# Altium project SVPXFMC_Carrier_6U.PrjPcb (part 8 of 9)
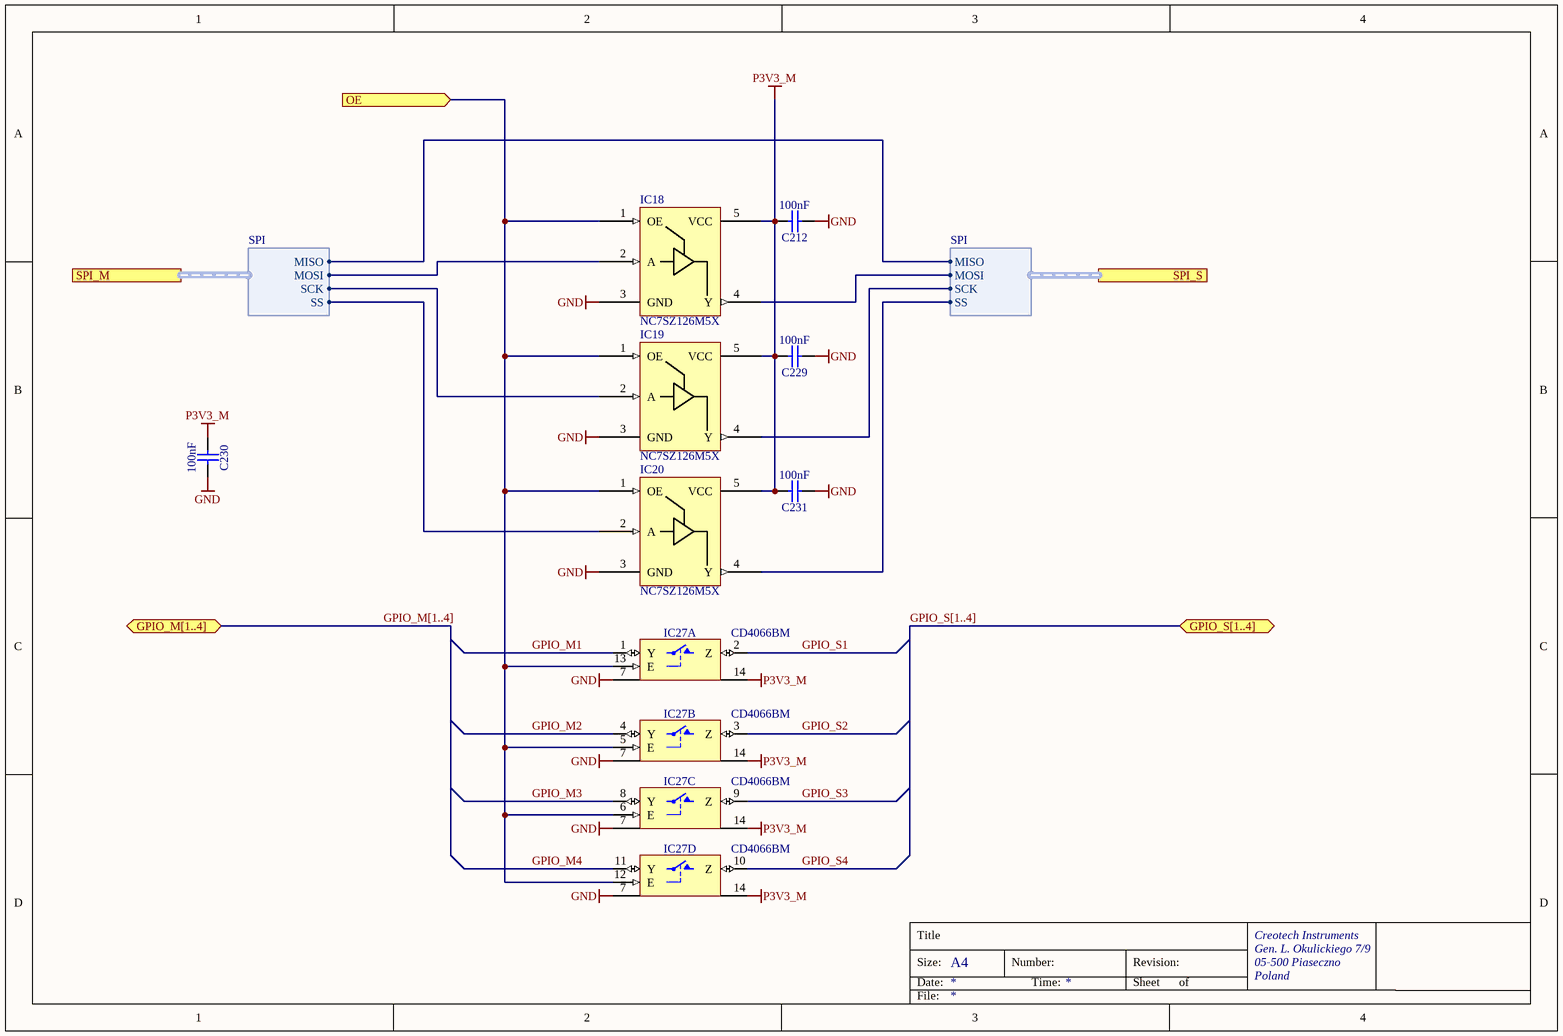
[diagram p23: Interface_Protection.SchDoc]
## Nets that join several sheets
GND: LCL (21 pins), LCL_sch (21 pins), FMC Carrier Channel1/U_FMC_connector (182 pins), FMC Carrier Channel1/FPGA_RGMII_Misc (C225A.1 IC22A.2), FMC Carrier Channel1/Supply for FPGA, FMC and SDRAM (58 pins), FMC Carrier Channel1/U_FPGA SDRAM bank (7 pins), FMC Carrier Channel1/U_FPGA Supply (99 pins), FMC Carrier Channel1/U_DDR4 SDRAM (116 pins), FMC Carrier Channel1/FPGA config (16 pins), FMC Carrier Channel1/U_Decoupling_caps (84 pins), FMC Carrier Channel1/U_CAN_IFC (9 pins), FMC Carrier Channel2/U_FMC_connector (182 pins), FMC Carrier Channel2/FPGA_RGMII_Misc (C225B.1 IC22B.2), FMC Carrier Channel2/Supply for FPGA, FMC and SDRAM (58 pins), FMC Carrier Channel2/U_FPGA SDRAM bank (7 pins), FMC Carrier Channel2/U_FPGA Supply (99 pins), FMC Carrier Channel2/U_DDR4 SDRAM (116 pins), FMC Carrier Channel2/FPGA config (16 pins), FMC Carrier Channel2/U_Decoupling_caps (84 pins), FMC Carrier Channel2/U_CAN_IFC (9 pins), HDN_Control_Data (40 pins), HDN_Management (12 pins), MSP_Telemetry (11 pins), MSP_Power_Program (21 pins), FRAM_memory (6 pins), Interface_prot_A (8 pins), Interface_prot_B (8 pins)
MIC_VIN: FMC Carrier Channel1/Supply for FPGA, FMC and SDRAM (C10A.2 IC12A.4), FMC Carrier Channel2/Supply for FPGA, FMC and SDRAM (C10B.2 IC12B.4)
P1V0: FMC Carrier Channel1/Supply for FPGA, FMC and SDRAM (18 pins), FMC Carrier Channel2/Supply for FPGA, FMC and SDRAM (18 pins)
P1V0_CORE: FMC Carrier Channel1/Supply for FPGA, FMC and SDRAM (IC5A.5 L3A.1 R20A.2), FMC Carrier Channel1/U_FPGA Supply (15 pins), FMC Carrier Channel1/U_Decoupling_caps (17 pins), FMC Carrier Channel2/Supply for FPGA, FMC and SDRAM (IC5B.5 L3B.1 R20B.2), FMC Carrier Channel2/U_FPGA Supply (15 pins), FMC Carrier Channel2/U_Decoupling_caps (17 pins)
P1V0_XCVR: FMC Carrier Channel1/Supply for FPGA, FMC and SDRAM (L3A.2), FMC Carrier Channel1/U_FPGA Supply (16 pins), FMC Carrier Channel1/U_Decoupling_caps (11 pins), FMC Carrier Channel2/Supply for FPGA, FMC and SDRAM (L3B.2), FMC Carrier Channel2/U_FPGA Supply (16 pins), FMC Carrier Channel2/U_Decoupling_caps (11 pins)
P1V2: FMC Carrier Channel1/Supply for FPGA, FMC and SDRAM (6 pins), FMC Carrier Channel2/Supply for FPGA, FMC and SDRAM (6 pins)
P1V2_DDR: FMC Carrier Channel1/Supply for FPGA, FMC and SDRAM (IC23A.5 R22A.2), FMC Carrier Channel1/U_FPGA Supply (12 pins), FMC Carrier Channel1/U_DDR4 SDRAM (89 pins), FMC Carrier Channel1/U_Decoupling_caps (12 pins), FMC Carrier Channel2/Supply for FPGA, FMC and SDRAM (IC23B.5 R22B.2), FMC Carrier Channel2/U_FPGA Supply (12 pins), FMC Carrier Channel2/U_DDR4 SDRAM (89 pins), FMC Carrier Channel2/U_Decoupling_caps (12 pins)
P1V8: FMC Carrier Channel1/Supply for FPGA, FMC and SDRAM (IC28A.5 R164A.2), FMC Carrier Channel1/U_FPGA Supply (U2A#5.P12 U2A#5.P14 U2A#5.P16 U2A#5.R14), FMC Carrier Channel1/U_Decoupling_caps (6 pins), FMC Carrier Channel2/Supply for FPGA, FMC and SDRAM (IC28B.5 R164B.2), FMC Carrier Channel2/U_FPGA Supply (U2B#5.P12 U2B#5.P14 U2B#5.P16 U2B#5.R14), FMC Carrier Channel2/U_Decoupling_caps (6 pins)
P1V8_LDO: FMC Carrier Channel1/Supply for FPGA, FMC and SDRAM (7 pins), FMC Carrier Channel2/Supply for FPGA, FMC and SDRAM (7 pins)
P2V5: FMC Carrier Channel1/FPGA_RGMII_Misc (C225A.2 IC22A.1 IC22A.4), FMC Carrier Channel1/Supply for FPGA, FMC and SDRAM (6 pins), FMC Carrier Channel1/U_FPGA Supply (20 pins), FMC Carrier Channel1/U_DDR4 SDRAM (8 pins), FMC Carrier Channel1/FPGA config (C200A.1 C201A.2 J7A.6), FMC Carrier Channel1/U_Decoupling_caps (15 pins), FMC Carrier Channel1/U_CAN_IFC (C1A.2 IC1A.19), FMC Carrier Channel2/FPGA_RGMII_Misc (C225B.2 IC22B.1 IC22B.4), FMC Carrier Channel2/Supply for FPGA, FMC and SDRAM (6 pins), FMC Carrier Channel2/U_FPGA Supply (20 pins), FMC Carrier Channel2/U_DDR4 SDRAM (8 pins), FMC Carrier Channel2/FPGA config (C200B.1 C201B.2 J7B.6), FMC Carrier Channel2/U_Decoupling_caps (15 pins), FMC Carrier Channel2/U_CAN_IFC (C1B.2 IC1B.19)
P2V5_Buck: FMC Carrier Channel1/Supply for FPGA, FMC and SDRAM (IC7A.4 IC8A.4 R21A.1 R165A.1), FMC Carrier Channel2/Supply for FPGA, FMC and SDRAM (IC7B.4 IC8B.4 R21B.1 R165B.1)
P2V5_PLL: FMC Carrier Channel1/Supply for FPGA, FMC and SDRAM (L5A.2), FMC Carrier Channel1/U_FPGA Supply (U2A#5.G18 U2A#5.L18 U2A#5.R18 U2A#5.V19), FMC Carrier Channel1/U_Decoupling_caps (5 pins), FMC Carrier Channel2/Supply for FPGA, FMC and SDRAM (L5B.2), FMC Carrier Channel2/U_FPGA Supply (U2B#5.G18 U2B#5.L18 U2B#5.R18 U2B#5.V19), FMC Carrier Channel2/U_Decoupling_caps (5 pins)
P2V5_XCVR: FMC Carrier Channel1/Supply for FPGA, FMC and SDRAM (L4A.2), FMC Carrier Channel1/U_FPGA Supply (7 pins), FMC Carrier Channel1/U_Decoupling_caps (9 pins), FMC Carrier Channel2/Supply for FPGA, FMC and SDRAM (L4B.2), FMC Carrier Channel2/U_FPGA Supply (7 pins), FMC Carrier Channel2/U_Decoupling_caps (9 pins)
P3V3: FMC Carrier Channel1/FPGA_FMC (R85A.2 R86A.2), FMC Carrier Channel1/Supply for FPGA, FMC and SDRAM (IC9A.5 R166A.2), FMC Carrier Channel1/U_FPGA Supply (5 pins), FMC Carrier Channel1/U_DDR4 SDRAM (C29A.1 IC15A.7 IC15A.10 R60A.2), FMC Carrier Channel1/FPGA config (12 pins), FMC Carrier Channel1/U_Decoupling_caps (C128A.1 C133A.1 C138A.1 C272A.1), FMC Carrier Channel1/U_CAN_IFC (7 pins), FMC Carrier Channel2/FPGA_FMC (R85B.2 R86B.2), FMC Carrier Channel2/Supply for FPGA, FMC and SDRAM (IC9B.5 R166B.2), FMC Carrier Channel2/U_FPGA Supply (5 pins), FMC Carrier Channel2/U_DDR4 SDRAM (C29B.1 IC15B.7 IC15B.10 R60B.2), FMC Carrier Channel2/FPGA config (12 pins), FMC Carrier Channel2/U_Decoupling_caps (C128B.1 C133B.1 C138B.1 C272B.1), FMC Carrier Channel2/U_CAN_IFC (7 pins)
P3V3_buck: FMC Carrier Channel1/Supply for FPGA, FMC and SDRAM (IC9A.4 R166A.1), FMC Carrier Channel2/Supply for FPGA, FMC and SDRAM (IC9B.4 R166B.1)
P3V3_M: FMC Carrier Channel1/Supply for FPGA, FMC and SDRAM (12 pins), FMC Carrier Channel2/Supply for FPGA, FMC and SDRAM (12 pins), HDN_Management (D12.5), MSP_Telemetry (13 pins), MSP_Power_Program (15 pins), Interface_prot_A (8 pins), Interface_prot_B (8 pins)
P5V0: FMC Carrier Channel1/Supply for FPGA, FMC and SDRAM (C254A.2 C255A.2), FMC Carrier Channel2/Supply for FPGA, FMC and SDRAM (C254B.2 C255B.2)
TPS_VIN: FMC Carrier Channel1/Supply for FPGA, FMC and SDRAM (6 pins), FMC Carrier Channel2/Supply for FPGA, FMC and SDRAM (6 pins)
VCC: LCL (13 pins), LCL_sch (13 pins)
VDDAUX2: FMC Carrier Channel1/U_FPGA Supply (U2A#5.H14 U2A#5.H16 U2A#5.J11 U2A#5.J13), FMC Carrier Channel1/U_Decoupling_caps (5 pins), FMC Carrier Channel2/U_FPGA Supply (U2B#5.H14 U2B#5.H16 U2B#5.J11 U2B#5.J13), FMC Carrier Channel2/U_Decoupling_caps (5 pins)
VTT32: FMC Carrier Channel1/U_FPGA SDRAM bank (C226A.1 R98A.2), FMC Carrier Channel1/U_DDR4 SDRAM (42 pins), FMC Carrier Channel2/U_FPGA SDRAM bank (C226B.1 R98B.2), FMC Carrier Channel2/U_DDR4 SDRAM (42 pins)
AUX_CLK_A_N: FMC Carrier Channel1/FPGA_MGT (C214A.2), HDN_Management (P3.C8)
AUX_CLK_A_N: FMC Carrier Channel2/FPGA_MGT (C214B.2), HDN_Control_Data (P1.G7)
AUX_CLK_A_P: FMC Carrier Channel1/FPGA_MGT (C213A.2), HDN_Management (P3.B8)
AUX_CLK_A_P: FMC Carrier Channel2/FPGA_MGT (C213B.2), HDN_Control_Data (P1.G9)
CAN_CSn: FMC Carrier Channel1/FPGA_RGMII_Misc (U2A#2.P7), FMC Carrier Channel1/U_CAN_IFC (IC1A.20)
CAN_CSn: FMC Carrier Channel2/FPGA_RGMII_Misc (U2B#2.P7), FMC Carrier Channel2/U_CAN_IFC (IC1B.20)
CAN_INT: FMC Carrier Channel1/FPGA_RGMII_Misc (U2A#2.N6), FMC Carrier Channel1/U_CAN_IFC (IC1A.15)
CAN_INT: FMC Carrier Channel2/FPGA_RGMII_Misc (U2B#2.N6), FMC Carrier Channel2/U_CAN_IFC (IC1B.15)
CAN_INT0: FMC Carrier Channel1/FPGA_RGMII_Misc (U2A#2.M8), FMC Carrier Channel1/U_CAN_IFC (IC1A.13)
CAN_INT0: FMC Carrier Channel2/FPGA_RGMII_Misc (U2B#2.M8), FMC Carrier Channel2/U_CAN_IFC (IC1B.13)
CAN_INT1: FMC Carrier Channel1/FPGA_RGMII_Misc (U2A#2.N5), FMC Carrier Channel1/U_CAN_IFC (IC1A.14)
CAN_INT1: FMC Carrier Channel2/FPGA_RGMII_Misc (U2B#2.N5), FMC Carrier Channel2/U_CAN_IFC (IC1B.14)
CAN_MISO: FMC Carrier Channel1/FPGA_RGMII_Misc (U2A#2.P8), FMC Carrier Channel1/U_CAN_IFC (IC1A.18)
CAN_MISO: FMC Carrier Channel2/FPGA_RGMII_Misc (U2B#2.P8), FMC Carrier Channel2/U_CAN_IFC (IC1B.18)
CAN_MOSI: FMC Carrier Channel1/FPGA_RGMII_Misc (U2A#2.N7), FMC Carrier Channel1/U_CAN_IFC (IC1A.17)
CAN_MOSI: FMC Carrier Channel2/FPGA_RGMII_Misc (U2B#2.N7), FMC Carrier Channel2/U_CAN_IFC (IC1B.17)
CAN_SCK: FMC Carrier Channel1/FPGA_RGMII_Misc (U2A#2.N8), FMC Carrier Channel1/U_CAN_IFC (IC1A.16)
CAN_SCK: FMC Carrier Channel2/FPGA_RGMII_Misc (U2B#2.N8), FMC Carrier Channel2/U_CAN_IFC (IC1B.16)
CANA_N: FMC Carrier Channel1/U_CAN_IFC (D1A.2 IC2A.6 R1A.2 R3A.2), HDN_Control_Data (R114.2)
CANA_P: FMC Carrier Channel1/U_CAN_IFC (D1A.1 IC2A.7 R1A.1 R3A.1), HDN_Control_Data (R113.1)
CANB_N: FMC Carrier Channel2/U_CAN_IFC (D1B.2 IC2B.6 R1B.2 R3B.2), HDN_Control_Data (R112.1)
CANB_P: FMC Carrier Channel2/U_CAN_IFC (D1B.1 IC2B.7 R1B.1 R3B.1), HDN_Control_Data (R111.2)
DDR4_A0: FMC Carrier Channel1/U_FPGA SDRAM bank (U2A#4.U5), FMC Carrier Channel1/U_DDR4 SDRAM (IC13A.P3 IC14A.P3 R169A.2)
DDR4_A0: FMC Carrier Channel2/U_FPGA SDRAM bank (U2B#4.U5), FMC Carrier Channel2/U_DDR4 SDRAM (IC13B.P3 IC14B.P3 R169B.2)
DDR4_A1: FMC Carrier Channel1/U_FPGA SDRAM bank (U2A#4.U4), FMC Carrier Channel1/U_DDR4 SDRAM (IC13A.P7 IC14A.P7 R170A.2)
DDR4_A1: FMC Carrier Channel2/U_FPGA SDRAM bank (U2B#4.U4), FMC Carrier Channel2/U_DDR4 SDRAM (IC13B.P7 IC14B.P7 R170B.2)
DDR4_A2: FMC Carrier Channel1/U_FPGA SDRAM bank (U2A#4.V4), FMC Carrier Channel1/U_DDR4 SDRAM (IC13A.R3 IC14A.R3 R28A.2)
DDR4_A2: FMC Carrier Channel2/U_FPGA SDRAM bank (U2B#4.V4), FMC Carrier Channel2/U_DDR4 SDRAM (IC13B.R3 IC14B.R3 R28B.2)
DDR4_A3: FMC Carrier Channel1/U_FPGA SDRAM bank (U2A#4.W3), FMC Carrier Channel1/U_DDR4 SDRAM (IC13A.N7 IC14A.N7 R29A.2)
DDR4_A3: FMC Carrier Channel2/U_FPGA SDRAM bank (U2B#4.W3), FMC Carrier Channel2/U_DDR4 SDRAM (IC13B.N7 IC14B.N7 R29B.2)
DDR4_A4: FMC Carrier Channel1/U_FPGA SDRAM bank (U2A#4.V5), FMC Carrier Channel1/U_DDR4 SDRAM (IC13A.N3 IC14A.N3 R30A.2)
DDR4_A4: FMC Carrier Channel2/U_FPGA SDRAM bank (U2B#4.V5), FMC Carrier Channel2/U_DDR4 SDRAM (IC13B.N3 IC14B.N3 R30B.2)
DDR4_A5: FMC Carrier Channel1/U_FPGA SDRAM bank (U2A#4.W4), FMC Carrier Channel1/U_DDR4 SDRAM (IC13A.P8 IC14A.P8 R31A.2)
DDR4_A5: FMC Carrier Channel2/U_FPGA SDRAM bank (U2B#4.W4), FMC Carrier Channel2/U_DDR4 SDRAM (IC13B.P8 IC14B.P8 R31B.2)
DDR4_A6: FMC Carrier Channel1/U_FPGA SDRAM bank (U2A#4.Y3), FMC Carrier Channel1/U_DDR4 SDRAM (IC13A.P2 IC14A.P2 R32A.2)
DDR4_A6: FMC Carrier Channel2/U_FPGA SDRAM bank (U2B#4.Y3), FMC Carrier Channel2/U_DDR4 SDRAM (IC13B.P2 IC14B.P2 R32B.2)
DDR4_A7: FMC Carrier Channel1/U_FPGA SDRAM bank (U2A#4.AA3), FMC Carrier Channel1/U_DDR4 SDRAM (IC13A.R8 IC14A.R8 R33A.2)
DDR4_A7: FMC Carrier Channel2/U_FPGA SDRAM bank (U2B#4.AA3), FMC Carrier Channel2/U_DDR4 SDRAM (IC13B.R8 IC14B.R8 R33B.2)
DDR4_A8: FMC Carrier Channel1/U_FPGA SDRAM bank (U2A#4.Y4), FMC Carrier Channel1/U_DDR4 SDRAM (IC13A.R2 IC14A.R2 R34A.2)
DDR4_A8: FMC Carrier Channel2/U_FPGA SDRAM bank (U2B#4.Y4), FMC Carrier Channel2/U_DDR4 SDRAM (IC13B.R2 IC14B.R2 R34B.2)
DDR4_A9: FMC Carrier Channel1/U_FPGA SDRAM bank (U2A#4.Y5), FMC Carrier Channel1/U_DDR4 SDRAM (IC13A.R7 IC14A.R7 R35A.2)
DDR4_A9: FMC Carrier Channel2/U_FPGA SDRAM bank (U2B#4.Y5), FMC Carrier Channel2/U_DDR4 SDRAM (IC13B.R7 IC14B.R7 R35B.2)
DDR4_A10: FMC Carrier Channel1/U_FPGA SDRAM bank (U2A#4.AA2), FMC Carrier Channel1/U_DDR4 SDRAM (IC13A.M3 IC14A.M3 R36A.2)
DDR4_A10: FMC Carrier Channel2/U_FPGA SDRAM bank (U2B#4.AA2), FMC Carrier Channel2/U_DDR4 SDRAM (IC13B.M3 IC14B.M3 R36B.2)
DDR4_A11: FMC Carrier Channel1/U_FPGA SDRAM bank (U2A#4.AB2), FMC Carrier Channel1/U_DDR4 SDRAM (IC13A.T2 IC14A.T2 R37A.2)
DDR4_A11: FMC Carrier Channel2/U_FPGA SDRAM bank (U2B#4.AB2), FMC Carrier Channel2/U_DDR4 SDRAM (IC13B.T2 IC14B.T2 R37B.2)
DDR4_A12: FMC Carrier Channel1/U_FPGA SDRAM bank (U2A#4.V6), FMC Carrier Channel1/U_DDR4 SDRAM (IC13A.M7 IC14A.M7 R38A.2)
DDR4_A12: FMC Carrier Channel2/U_FPGA SDRAM bank (U2B#4.V6), FMC Carrier Channel2/U_DDR4 SDRAM (IC13B.M7 IC14B.M7 R38B.2)
DDR4_A13: FMC Carrier Channel1/U_FPGA SDRAM bank (U2A#4.W6), FMC Carrier Channel1/U_DDR4 SDRAM (IC13A.T8 IC14A.T8 R39A.2)
DDR4_A13: FMC Carrier Channel2/U_FPGA SDRAM bank (U2B#4.W6), FMC Carrier Channel2/U_DDR4 SDRAM (IC13B.T8 IC14B.T8 R39B.2)
DDR4_A14_WE_B: FMC Carrier Channel1/U_FPGA SDRAM bank (U2A#4.AB3), FMC Carrier Channel1/U_DDR4 SDRAM (IC13A.L2 IC14A.L2 R40A.2)
DDR4_A14_WE_B: FMC Carrier Channel2/U_FPGA SDRAM bank (U2B#4.AB3), FMC Carrier Channel2/U_DDR4 SDRAM (IC13B.L2 IC14B.L2 R40B.2)
DDR4_A15_CAS_B: FMC Carrier Channel1/U_FPGA SDRAM bank (U2A#4.AB4), FMC Carrier Channel1/U_DDR4 SDRAM (IC13A.M8 IC14A.M8 R41A.2)
DDR4_A15_CAS_B: FMC Carrier Channel2/U_FPGA SDRAM bank (U2B#4.AB4), FMC Carrier Channel2/U_DDR4 SDRAM (IC13B.M8 IC14B.M8 R41B.2)
DDR4_A16_RAS_B: FMC Carrier Channel1/U_FPGA SDRAM bank (U2A#4.U7), FMC Carrier Channel1/U_DDR4 SDRAM (IC13A.L8 IC14A.L8 R42A.2)
DDR4_A16_RAS_B: FMC Carrier Channel2/U_FPGA SDRAM bank (U2B#4.U7), FMC Carrier Channel2/U_DDR4 SDRAM (IC13B.L8 IC14B.L8 R42B.2)
DDR4_ACT_B: FMC Carrier Channel1/U_FPGA SDRAM bank (U2A#4.AA6), FMC Carrier Channel1/U_DDR4 SDRAM (IC13A.L3 IC14A.L3 R47A.2)
DDR4_ACT_B: FMC Carrier Channel2/U_FPGA SDRAM bank (U2B#4.AA6), FMC Carrier Channel2/U_DDR4 SDRAM (IC13B.L3 IC14B.L3 R47B.2)
DDR4_ALERT_B: FMC Carrier Channel1/U_FPGA SDRAM bank (R96A.2 U2A#4.AB7), FMC Carrier Channel1/U_DDR4 SDRAM (IC13A.P9 IC14A.P9 R54A.2)
DDR4_ALERT_B: FMC Carrier Channel2/U_FPGA SDRAM bank (R96B.2 U2B#4.AB7), FMC Carrier Channel2/U_DDR4 SDRAM (IC13B.P9 IC14B.P9 R54B.2)
DDR4_BA0: FMC Carrier Channel1/U_FPGA SDRAM bank (U2A#4.V7), FMC Carrier Channel1/U_DDR4 SDRAM (IC13A.N2 IC14A.N2 R52A.2)
DDR4_BA0: FMC Carrier Channel2/U_FPGA SDRAM bank (U2B#4.V7), FMC Carrier Channel2/U_DDR4 SDRAM (IC13B.N2 IC14B.N2 R52B.2)
DDR4_BA1: FMC Carrier Channel1/U_FPGA SDRAM bank (U2A#4.Y6), FMC Carrier Channel1/U_DDR4 SDRAM (IC13A.N8 IC14A.N8 R53A.2)
DDR4_BA1: FMC Carrier Channel2/U_FPGA SDRAM bank (U2B#4.Y6), FMC Carrier Channel2/U_DDR4 SDRAM (IC13B.N8 IC14B.N8 R53B.2)
DDR4_BG0: FMC Carrier Channel1/U_FPGA SDRAM bank (U2A#4.AA5), FMC Carrier Channel1/U_DDR4 SDRAM (IC13A.M2 IC14A.M2 R55A.2)
DDR4_BG0: FMC Carrier Channel2/U_FPGA SDRAM bank (U2B#4.AA5), FMC Carrier Channel2/U_DDR4 SDRAM (IC13B.M2 IC14B.M2 R55B.2)
DDR4_CK_C: FMC Carrier Channel1/U_FPGA SDRAM bank (U2A#4.W1), FMC Carrier Channel1/U_DDR4 SDRAM (IC13A.K8 IC14A.K8 R44A.2)
DDR4_CK_C: FMC Carrier Channel2/U_FPGA SDRAM bank (U2B#4.W1), FMC Carrier Channel2/U_DDR4 SDRAM (IC13B.K8 IC14B.K8 R44B.2)
DDR4_CK_T: FMC Carrier Channel1/U_FPGA SDRAM bank (U2A#4.V1), FMC Carrier Channel1/U_DDR4 SDRAM (IC13A.K7 IC14A.K7 R43A.2)
DDR4_CK_T: FMC Carrier Channel2/U_FPGA SDRAM bank (U2B#4.V1), FMC Carrier Channel2/U_DDR4 SDRAM (IC13B.K7 IC14B.K7 R43B.2)
DDR4_CKE: FMC Carrier Channel1/U_FPGA SDRAM bank (U2A#4.W8), FMC Carrier Channel1/U_DDR4 SDRAM (IC13A.K2 IC14A.K2 R45A.2)
DDR4_CKE: FMC Carrier Channel2/U_FPGA SDRAM bank (U2B#4.W8), FMC Carrier Channel2/U_DDR4 SDRAM (IC13B.K2 IC14B.K2 R45B.2)
DDR4_CS_B: FMC Carrier Channel1/U_FPGA SDRAM bank (U2A#4.W7), FMC Carrier Channel1/U_DDR4 SDRAM (IC13A.L7 IC14A.L7 R49A.2)
DDR4_CS_B: FMC Carrier Channel2/U_FPGA SDRAM bank (U2B#4.W7), FMC Carrier Channel2/U_DDR4 SDRAM (IC13B.L7 IC14B.L7 R49B.2)
DDR4_DM0: FMC Carrier Channel1/U_FPGA SDRAM bank (U2A#4.Y9), FMC Carrier Channel1/U_DDR4 SDRAM (IC13A.E7)
DDR4_DM0: FMC Carrier Channel2/U_FPGA SDRAM bank (U2B#4.Y9), FMC Carrier Channel2/U_DDR4 SDRAM (IC13B.E7)
DDR4_DM1: FMC Carrier Channel1/U_FPGA SDRAM bank (U2A#4.R15), FMC Carrier Channel1/U_DDR4 SDRAM (IC13A.E2)
DDR4_DM1: FMC Carrier Channel2/U_FPGA SDRAM bank (U2B#4.R15), FMC Carrier Channel2/U_DDR4 SDRAM (IC13B.E2)
DDR4_DM2: FMC Carrier Channel1/U_FPGA SDRAM bank (U2A#4.AA10), FMC Carrier Channel1/U_DDR4 SDRAM (IC14A.E7)
DDR4_DM2: FMC Carrier Channel2/U_FPGA SDRAM bank (U2B#4.AA10), FMC Carrier Channel2/U_DDR4 SDRAM (IC14B.E7)
DDR4_DM3: FMC Carrier Channel1/U_FPGA SDRAM bank (U2A#4.AA15), FMC Carrier Channel1/U_DDR4 SDRAM (IC14A.E2)
DDR4_DM3: FMC Carrier Channel2/U_FPGA SDRAM bank (U2B#4.AA15), FMC Carrier Channel2/U_DDR4 SDRAM (IC14B.E2)
DDR4_DQ0: FMC Carrier Channel1/U_FPGA SDRAM bank (U2A#4.T8), FMC Carrier Channel1/U_DDR4 SDRAM (IC13A.G2)
DDR4_DQ0: FMC Carrier Channel2/U_FPGA SDRAM bank (U2B#4.T8), FMC Carrier Channel2/U_DDR4 SDRAM (IC13B.G2)
DDR4_DQ1: FMC Carrier Channel1/U_FPGA SDRAM bank (U2A#4.U8), FMC Carrier Channel1/U_DDR4 SDRAM (IC13A.F7)
DDR4_DQ1: FMC Carrier Channel2/U_FPGA SDRAM bank (U2B#4.U8), FMC Carrier Channel2/U_DDR4 SDRAM (IC13B.F7)
DDR4_DQ2: FMC Carrier Channel1/U_FPGA SDRAM bank (U2A#4.T7), FMC Carrier Channel1/U_DDR4 SDRAM (IC13A.H3)
DDR4_DQ2: FMC Carrier Channel2/U_FPGA SDRAM bank (U2B#4.T7), FMC Carrier Channel2/U_DDR4 SDRAM (IC13B.H3)
DDR4_DQ3: FMC Carrier Channel1/U_FPGA SDRAM bank (U2A#4.U9), FMC Carrier Channel1/U_DDR4 SDRAM (IC13A.H7)
DDR4_DQ3: FMC Carrier Channel2/U_FPGA SDRAM bank (U2B#4.U9), FMC Carrier Channel2/U_DDR4 SDRAM (IC13B.H7)
DDR4_DQ4: FMC Carrier Channel1/U_FPGA SDRAM bank (U2A#4.V9), FMC Carrier Channel1/U_DDR4 SDRAM (IC13A.H2)
DDR4_DQ4: FMC Carrier Channel2/U_FPGA SDRAM bank (U2B#4.V9), FMC Carrier Channel2/U_DDR4 SDRAM (IC13B.H2)
DDR4_DQ5: FMC Carrier Channel1/U_FPGA SDRAM bank (U2A#4.V10), FMC Carrier Channel1/U_DDR4 SDRAM (IC13A.H8)
DDR4_DQ5: FMC Carrier Channel2/U_FPGA SDRAM bank (U2B#4.V10), FMC Carrier Channel2/U_DDR4 SDRAM (IC13B.H8)
DDR4_DQ6: FMC Carrier Channel1/U_FPGA SDRAM bank (U2A#4.W9), FMC Carrier Channel1/U_DDR4 SDRAM (IC13A.J3)
DDR4_DQ6: FMC Carrier Channel2/U_FPGA SDRAM bank (U2B#4.W9), FMC Carrier Channel2/U_DDR4 SDRAM (IC13B.J3)
DDR4_DQ7: FMC Carrier Channel1/U_FPGA SDRAM bank (U2A#4.R10), FMC Carrier Channel1/U_DDR4 SDRAM (IC13A.J7)
DDR4_DQ7: FMC Carrier Channel2/U_FPGA SDRAM bank (U2B#4.R10), FMC Carrier Channel2/U_DDR4 SDRAM (IC13B.J7)
DDR4_DQ8: FMC Carrier Channel1/U_FPGA SDRAM bank (U2A#4.R12), FMC Carrier Channel1/U_DDR4 SDRAM (IC13A.A3)
DDR4_DQ8: FMC Carrier Channel2/U_FPGA SDRAM bank (U2B#4.R12), FMC Carrier Channel2/U_DDR4 SDRAM (IC13B.A3)
DDR4_DQ9: FMC Carrier Channel1/U_FPGA SDRAM bank (U2A#4.V14), FMC Carrier Channel1/U_DDR4 SDRAM (IC13A.B8)
DDR4_DQ9: FMC Carrier Channel2/U_FPGA SDRAM bank (U2B#4.V14), FMC Carrier Channel2/U_DDR4 SDRAM (IC13B.B8)
DDR4_DQ10: FMC Carrier Channel1/U_FPGA SDRAM bank (U2A#4.T11), FMC Carrier Channel1/U_DDR4 SDRAM (IC13A.C3)
DDR4_DQ10: FMC Carrier Channel2/U_FPGA SDRAM bank (U2B#4.T11), FMC Carrier Channel2/U_DDR4 SDRAM (IC13B.C3)
DDR4_DQ11: FMC Carrier Channel1/U_FPGA SDRAM bank (U2A#4.U14), FMC Carrier Channel1/U_DDR4 SDRAM (IC13A.C7)
DDR4_DQ11: FMC Carrier Channel2/U_FPGA SDRAM bank (U2B#4.U14), FMC Carrier Channel2/U_DDR4 SDRAM (IC13B.C7)
DDR4_DQ12: FMC Carrier Channel1/U_FPGA SDRAM bank (U2A#4.T15), FMC Carrier Channel1/U_DDR4 SDRAM (IC13A.C2)
DDR4_DQ12: FMC Carrier Channel2/U_FPGA SDRAM bank (U2B#4.T15), FMC Carrier Channel2/U_DDR4 SDRAM (IC13B.C2)
DDR4_DQ13: FMC Carrier Channel1/U_FPGA SDRAM bank (U2A#4.U13), FMC Carrier Channel1/U_DDR4 SDRAM (IC13A.C8)
DDR4_DQ13: FMC Carrier Channel2/U_FPGA SDRAM bank (U2B#4.U13), FMC Carrier Channel2/U_DDR4 SDRAM (IC13B.C8)
DDR4_DQ14: FMC Carrier Channel1/U_FPGA SDRAM bank (U2A#4.T13), FMC Carrier Channel1/U_DDR4 SDRAM (IC13A.D3)
DDR4_DQ14: FMC Carrier Channel2/U_FPGA SDRAM bank (U2B#4.T13), FMC Carrier Channel2/U_DDR4 SDRAM (IC13B.D3)
DDR4_DQ15: FMC Carrier Channel1/U_FPGA SDRAM bank (U2A#4.U15), FMC Carrier Channel1/U_DDR4 SDRAM (IC13A.D7)
DDR4_DQ15: FMC Carrier Channel2/U_FPGA SDRAM bank (U2B#4.U15), FMC Carrier Channel2/U_DDR4 SDRAM (IC13B.D7)
DDR4_DQ16: FMC Carrier Channel1/U_FPGA SDRAM bank (U2A#4.Y10), FMC Carrier Channel1/U_DDR4 SDRAM (IC14A.G2)
DDR4_DQ16: FMC Carrier Channel2/U_FPGA SDRAM bank (U2B#4.Y10), FMC Carrier Channel2/U_DDR4 SDRAM (IC14B.G2)
DDR4_DQ17: FMC Carrier Channel1/U_FPGA SDRAM bank (U2A#4.V11), FMC Carrier Channel1/U_DDR4 SDRAM (IC14A.F7)
DDR4_DQ17: FMC Carrier Channel2/U_FPGA SDRAM bank (U2B#4.V11), FMC Carrier Channel2/U_DDR4 SDRAM (IC14B.F7)
DDR4_DQ18: FMC Carrier Channel1/U_FPGA SDRAM bank (U2A#4.W11), FMC Carrier Channel1/U_DDR4 SDRAM (IC14A.H3)
DDR4_DQ18: FMC Carrier Channel2/U_FPGA SDRAM bank (U2B#4.W11), FMC Carrier Channel2/U_DDR4 SDRAM (IC14B.H3)
DDR4_DQ19: FMC Carrier Channel1/U_FPGA SDRAM bank (U2A#4.U12), FMC Carrier Channel1/U_DDR4 SDRAM (IC14A.H7)
DDR4_DQ19: FMC Carrier Channel2/U_FPGA SDRAM bank (U2B#4.U12), FMC Carrier Channel2/U_DDR4 SDRAM (IC14B.H7)
DDR4_DQ20: FMC Carrier Channel1/U_FPGA SDRAM bank (U2A#4.AA11), FMC Carrier Channel1/U_DDR4 SDRAM (IC14A.H2)
DDR4_DQ20: FMC Carrier Channel2/U_FPGA SDRAM bank (U2B#4.AA11), FMC Carrier Channel2/U_DDR4 SDRAM (IC14B.H2)
DDR4_DQ21: FMC Carrier Channel1/U_FPGA SDRAM bank (U2A#4.Y11), FMC Carrier Channel1/U_DDR4 SDRAM (IC14A.H8)
DDR4_DQ21: FMC Carrier Channel2/U_FPGA SDRAM bank (U2B#4.Y11), FMC Carrier Channel2/U_DDR4 SDRAM (IC14B.H8)
DDR4_DQ22: FMC Carrier Channel1/U_FPGA SDRAM bank (U2A#4.W12), FMC Carrier Channel1/U_DDR4 SDRAM (IC14A.J3)
DDR4_DQ22: FMC Carrier Channel2/U_FPGA SDRAM bank (U2B#4.W12), FMC Carrier Channel2/U_DDR4 SDRAM (IC14B.J3)
DDR4_DQ23: FMC Carrier Channel1/U_FPGA SDRAM bank (U2A#4.V12), FMC Carrier Channel1/U_DDR4 SDRAM (IC14A.J7)
DDR4_DQ23: FMC Carrier Channel2/U_FPGA SDRAM bank (U2B#4.V12), FMC Carrier Channel2/U_DDR4 SDRAM (IC14B.J7)
DDR4_DQ24: FMC Carrier Channel1/U_FPGA SDRAM bank (U2A#4.AA13), FMC Carrier Channel1/U_DDR4 SDRAM (IC14A.A3)
DDR4_DQ24: FMC Carrier Channel2/U_FPGA SDRAM bank (U2B#4.AA13), FMC Carrier Channel2/U_DDR4 SDRAM (IC14B.A3)
DDR4_DQ25: FMC Carrier Channel1/U_FPGA SDRAM bank (U2A#4.Y13), FMC Carrier Channel1/U_DDR4 SDRAM (IC14A.B8)
DDR4_DQ25: FMC Carrier Channel2/U_FPGA SDRAM bank (U2B#4.Y13), FMC Carrier Channel2/U_DDR4 SDRAM (IC14B.B8)
DDR4_DQ26: FMC Carrier Channel1/U_FPGA SDRAM bank (U2A#4.AB13), FMC Carrier Channel1/U_DDR4 SDRAM (IC14A.C3)
DDR4_DQ26: FMC Carrier Channel2/U_FPGA SDRAM bank (U2B#4.AB13), FMC Carrier Channel2/U_DDR4 SDRAM (IC14B.C3)
DDR4_DQ27: FMC Carrier Channel1/U_FPGA SDRAM bank (U2A#4.W13), FMC Carrier Channel1/U_DDR4 SDRAM (IC14A.C7)
DDR4_DQ27: FMC Carrier Channel2/U_FPGA SDRAM bank (U2B#4.W13), FMC Carrier Channel2/U_DDR4 SDRAM (IC14B.C7)
DDR4_DQ28: FMC Carrier Channel1/U_FPGA SDRAM bank (U2A#4.Y14), FMC Carrier Channel1/U_DDR4 SDRAM (IC14A.C2)
DDR4_DQ28: FMC Carrier Channel2/U_FPGA SDRAM bank (U2B#4.Y14), FMC Carrier Channel2/U_DDR4 SDRAM (IC14B.C2)
DDR4_DQ29: FMC Carrier Channel1/U_FPGA SDRAM bank (U2A#4.W14), FMC Carrier Channel1/U_DDR4 SDRAM (IC14A.C8)
DDR4_DQ29: FMC Carrier Channel2/U_FPGA SDRAM bank (U2B#4.W14), FMC Carrier Channel2/U_DDR4 SDRAM (IC14B.C8)
DDR4_DQ30: FMC Carrier Channel1/U_FPGA SDRAM bank (U2A#4.AB15), FMC Carrier Channel1/U_DDR4 SDRAM (IC14A.D3)
DDR4_DQ30: FMC Carrier Channel2/U_FPGA SDRAM bank (U2B#4.AB15), FMC Carrier Channel2/U_DDR4 SDRAM (IC14B.D3)
DDR4_DQ31: FMC Carrier Channel1/U_FPGA SDRAM bank (U2A#4.Y15), FMC Carrier Channel1/U_DDR4 SDRAM (IC14A.D7)
DDR4_DQ31: FMC Carrier Channel2/U_FPGA SDRAM bank (U2B#4.Y15), FMC Carrier Channel2/U_DDR4 SDRAM (IC14B.D7)
DDR4_DQS0_C: FMC Carrier Channel1/U_FPGA SDRAM bank (U2A#4.U10), FMC Carrier Channel1/U_DDR4 SDRAM (IC13A.F3)
DDR4_DQS0_C: FMC Carrier Channel2/U_FPGA SDRAM bank (U2B#4.U10), FMC Carrier Channel2/U_DDR4 SDRAM (IC13B.F3)
DDR4_DQS0_T: FMC Carrier Channel1/U_FPGA SDRAM bank (U2A#4.T10), FMC Carrier Channel1/U_DDR4 SDRAM (IC13A.G3)
DDR4_DQS0_T: FMC Carrier Channel2/U_FPGA SDRAM bank (U2B#4.T10), FMC Carrier Channel2/U_DDR4 SDRAM (IC13B.G3)
DDR4_DQS1_C: FMC Carrier Channel1/U_FPGA SDRAM bank (U2A#4.T12), FMC Carrier Channel1/U_DDR4 SDRAM (IC13A.A7)
DDR4_DQS1_C: FMC Carrier Channel2/U_FPGA SDRAM bank (U2B#4.T12), FMC Carrier Channel2/U_DDR4 SDRAM (IC13B.A7)
DDR4_DQS1_T: FMC Carrier Channel1/U_FPGA SDRAM bank (U2A#4.R13), FMC Carrier Channel1/U_DDR4 SDRAM (IC13A.B7)
DDR4_DQS1_T: FMC Carrier Channel2/U_FPGA SDRAM bank (U2B#4.R13), FMC Carrier Channel2/U_DDR4 SDRAM (IC13B.B7)
DDR4_DQS2_C: FMC Carrier Channel1/U_FPGA SDRAM bank (U2A#4.AB9), FMC Carrier Channel1/U_DDR4 SDRAM (IC14A.F3)
DDR4_DQS2_C: FMC Carrier Channel2/U_FPGA SDRAM bank (U2B#4.AB9), FMC Carrier Channel2/U_DDR4 SDRAM (IC14B.F3)
DDR4_DQS2_T: FMC Carrier Channel1/U_FPGA SDRAM bank (U2A#4.AB8), FMC Carrier Channel1/U_DDR4 SDRAM (IC14A.G3)
DDR4_DQS2_T: FMC Carrier Channel2/U_FPGA SDRAM bank (U2B#4.AB8), FMC Carrier Channel2/U_DDR4 SDRAM (IC14B.G3)
DDR4_DQS3_C: FMC Carrier Channel1/U_FPGA SDRAM bank (U2A#4.AB12), FMC Carrier Channel1/U_DDR4 SDRAM (IC14A.A7)
DDR4_DQS3_C: FMC Carrier Channel2/U_FPGA SDRAM bank (U2B#4.AB12), FMC Carrier Channel2/U_DDR4 SDRAM (IC14B.A7)
DDR4_DQS3_T: FMC Carrier Channel1/U_FPGA SDRAM bank (U2A#4.AA12), FMC Carrier Channel1/U_DDR4 SDRAM (IC14A.B7)
DDR4_DQS3_T: FMC Carrier Channel2/U_FPGA SDRAM bank (U2B#4.AA12), FMC Carrier Channel2/U_DDR4 SDRAM (IC14B.B7)
DDR4_ODT: FMC Carrier Channel1/U_FPGA SDRAM bank (U2A#4.AA7), FMC Carrier Channel1/U_DDR4 SDRAM (IC13A.K3 IC14A.K3 R51A.2)
DDR4_ODT: FMC Carrier Channel2/U_FPGA SDRAM bank (U2B#4.AA7), FMC Carrier Channel2/U_DDR4 SDRAM (IC13B.K3 IC14B.K3 R51B.2)
DDR4_PAR: FMC Carrier Channel1/U_FPGA SDRAM bank (U2A#4.AA8), FMC Carrier Channel1/U_DDR4 SDRAM (IC13A.T3 IC14A.T3 R48A.2)
DDR4_PAR: FMC Carrier Channel2/U_FPGA SDRAM bank (U2B#4.AA8), FMC Carrier Channel2/U_DDR4 SDRAM (IC13B.T3 IC14B.T3 R48B.2)
DDR4_TEN: FMC Carrier Channel1/U_FPGA SDRAM bank (R97A.2 U2A#4.Y1), FMC Carrier Channel1/U_DDR4 SDRAM (IC13A.N9 IC14A.N9 R50A.2)
DDR4_TEN: FMC Carrier Channel2/U_FPGA SDRAM bank (R97B.2 U2B#4.Y1), FMC Carrier Channel2/U_DDR4 SDRAM (IC13B.N9 IC14B.N9 R50B.2)
DP0_C2M_N: FMC Carrier Channel1/U_FMC_connector (J2A.c3), FMC Carrier Channel1/FPGA_MGT (C203A.2)
DP0_C2M_N: FMC Carrier Channel2/U_FMC_connector (J2B.c3), FMC Carrier Channel2/FPGA_MGT (C203B.2)
DP0_C2M_P: FMC Carrier Channel1/U_FMC_connector (J2A.c2), FMC Carrier Channel1/FPGA_MGT (C202A.2)
DP0_C2M_P: FMC Carrier Channel2/U_FMC_connector (J2B.c2), FMC Carrier Channel2/FPGA_MGT (C202B.2)
DP0_M2C_N: FMC Carrier Channel1/U_FMC_connector (J2A.c7), FMC Carrier Channel1/FPGA_MGT (U2A#3.A19)
DP0_M2C_N: FMC Carrier Channel2/U_FMC_connector (J2B.c7), FMC Carrier Channel2/FPGA_MGT (U2B#3.A19)
DP0_M2C_P: FMC Carrier Channel1/U_FMC_connector (J2A.c6), FMC Carrier Channel1/FPGA_MGT (U2A#3.A20)
DP0_M2C_P: FMC Carrier Channel2/U_FMC_connector (J2B.c6), FMC Carrier Channel2/FPGA_MGT (U2B#3.A20)
DP1_C2M_N: FMC Carrier Channel1/U_FMC_connector (J2A.a23), FMC Carrier Channel1/FPGA_MGT (C205A.2)
DP1_C2M_N: FMC Carrier Channel2/U_FMC_connector (J2B.a23), FMC Carrier Channel2/FPGA_MGT (C205B.2)
DP1_C2M_P: FMC Carrier Channel1/U_FMC_connector (J2A.a22), FMC Carrier Channel1/FPGA_MGT (C204A.2)
DP1_C2M_P: FMC Carrier Channel2/U_FMC_connector (J2B.a22), FMC Carrier Channel2/FPGA_MGT (C204B.2)
DP1_M2C_N: FMC Carrier Channel1/U_FMC_connector (J2A.a3), FMC Carrier Channel1/FPGA_MGT (U2A#3.C19)
DP1_M2C_N: FMC Carrier Channel2/U_FMC_connector (J2B.a3), FMC Carrier Channel2/FPGA_MGT (U2B#3.C19)
DP1_M2C_P: FMC Carrier Channel1/U_FMC_connector (J2A.a2), FMC Carrier Channel1/FPGA_MGT (U2A#3.C20)
DP1_M2C_P: FMC Carrier Channel2/U_FMC_connector (J2B.a2), FMC Carrier Channel2/FPGA_MGT (U2B#3.C20)
DP2_C2M_N: FMC Carrier Channel1/U_FMC_connector (J2A.a27), FMC Carrier Channel1/FPGA_MGT (C207A.2)
DP2_C2M_N: FMC Carrier Channel2/U_FMC_connector (J2B.a27), FMC Carrier Channel2/FPGA_MGT (C207B.2)
DP2_C2M_P: FMC Carrier Channel1/U_FMC_connector (J2A.a26), FMC Carrier Channel1/FPGA_MGT (C206A.2)
DP2_C2M_P: FMC Carrier Channel2/U_FMC_connector (J2B.a26), FMC Carrier Channel2/FPGA_MGT (C206B.2)
DP2_M2C_N: FMC Carrier Channel1/U_FMC_connector (J2A.a7), FMC Carrier Channel1/FPGA_MGT (U2A#3.F21)
DP2_M2C_N: FMC Carrier Channel2/U_FMC_connector (J2B.a7), FMC Carrier Channel2/FPGA_MGT (U2B#3.F21)
DP2_M2C_P: FMC Carrier Channel1/U_FMC_connector (J2A.a6), FMC Carrier Channel1/FPGA_MGT (U2A#3.F22)
DP2_M2C_P: FMC Carrier Channel2/U_FMC_connector (J2B.a6), FMC Carrier Channel2/FPGA_MGT (U2B#3.F22)
DP3_C2M_N: FMC Carrier Channel1/U_FMC_connector (J2A.a31), FMC Carrier Channel1/FPGA_MGT (C209A.2)
DP3_C2M_N: FMC Carrier Channel2/U_FMC_connector (J2B.a31), FMC Carrier Channel2/FPGA_MGT (C209B.2)
DP3_C2M_P: FMC Carrier Channel1/U_FMC_connector (J2A.a30), FMC Carrier Channel1/FPGA_MGT (C208A.2)
DP3_C2M_P: FMC Carrier Channel2/U_FMC_connector (J2B.a30), FMC Carrier Channel2/FPGA_MGT (C208B.2)
DP3_M2C_N: FMC Carrier Channel1/U_FMC_connector (J2A.a11), FMC Carrier Channel1/FPGA_MGT (U2A#3.K21)
DP3_M2C_N: FMC Carrier Channel2/U_FMC_connector (J2B.a11), FMC Carrier Channel2/FPGA_MGT (U2B#3.K21)
DP3_M2C_P: FMC Carrier Channel1/U_FMC_connector (J2A.a10), FMC Carrier Channel1/FPGA_MGT (U2A#3.K22)
DP3_M2C_P: FMC Carrier Channel2/U_FMC_connector (J2B.a10), FMC Carrier Channel2/FPGA_MGT (U2B#3.K22)
DP4_C2M_N: FMC Carrier Channel1/U_FMC_connector (J2A.a35), FMC Carrier Channel1/FPGA_MGT (C216A.2)
DP4_C2M_N: FMC Carrier Channel2/U_FMC_connector (J2B.a35), FMC Carrier Channel2/FPGA_MGT (C216B.2)
DP4_C2M_P: FMC Carrier Channel1/U_FMC_connector (J2A.a34), FMC Carrier Channel1/FPGA_MGT (C215A.2)
DP4_C2M_P: FMC Carrier Channel2/U_FMC_connector (J2B.a34), FMC Carrier Channel2/FPGA_MGT (C215B.2)
DP4_M2C_N: FMC Carrier Channel1/U_FMC_connector (J2A.a15), FMC Carrier Channel1/FPGA_MGT (U2A#3.M21)
DP4_M2C_N: FMC Carrier Channel2/U_FMC_connector (J2B.a15), FMC Carrier Channel2/FPGA_MGT (U2B#3.M21)
DP4_M2C_P: FMC Carrier Channel1/U_FMC_connector (J2A.a14), FMC Carrier Channel1/FPGA_MGT (U2A#3.M22)
DP4_M2C_P: FMC Carrier Channel2/U_FMC_connector (J2B.a14), FMC Carrier Channel2/FPGA_MGT (U2B#3.M22)
DP5_C2M_N: FMC Carrier Channel1/U_FMC_connector (J2A.a39), FMC Carrier Channel1/FPGA_MGT (C218A.2)
DP5_C2M_N: FMC Carrier Channel2/U_FMC_connector (J2B.a39), FMC Carrier Channel2/FPGA_MGT (C218B.2)
DP5_C2M_P: FMC Carrier Channel1/U_FMC_connector (J2A.a38), FMC Carrier Channel1/FPGA_MGT (C217A.2)
DP5_C2M_P: FMC Carrier Channel2/U_FMC_connector (J2B.a38), FMC Carrier Channel2/FPGA_MGT (C217B.2)
DP5_M2C_N: FMC Carrier Channel1/U_FMC_connector (J2A.a19), FMC Carrier Channel1/FPGA_MGT (U2A#3.T21)
DP5_M2C_N: FMC Carrier Channel2/U_FMC_connector (J2B.a19), FMC Carrier Channel2/FPGA_MGT (U2B#3.T21)
DP5_M2C_P: FMC Carrier Channel1/U_FMC_connector (J2A.a18), FMC Carrier Channel1/FPGA_MGT (U2A#3.T22)
DP5_M2C_P: FMC Carrier Channel2/U_FMC_connector (J2B.a18), FMC Carrier Channel2/FPGA_MGT (U2B#3.T22)
DP6_C2M_N: FMC Carrier Channel1/U_FMC_connector (J2A.b37), FMC Carrier Channel1/FPGA_MGT (C220A.2)
DP6_C2M_N: FMC Carrier Channel2/U_FMC_connector (J2B.b37), FMC Carrier Channel2/FPGA_MGT (C220B.2)
DP6_C2M_P: FMC Carrier Channel1/U_FMC_connector (J2A.b36), FMC Carrier Channel1/FPGA_MGT (C219A.2)
DP6_C2M_P: FMC Carrier Channel2/U_FMC_connector (J2B.b36), FMC Carrier Channel2/FPGA_MGT (C219B.2)
DP6_M2C_N: FMC Carrier Channel1/U_FMC_connector (J2A.b17), FMC Carrier Channel1/FPGA_MGT (U2A#3.W19)
DP6_M2C_N: FMC Carrier Channel2/U_FMC_connector (J2B.b17), FMC Carrier Channel2/FPGA_MGT (U2B#3.W19)
DP6_M2C_P: FMC Carrier Channel1/U_FMC_connector (J2A.b16), FMC Carrier Channel1/FPGA_MGT (U2A#3.W20)
DP6_M2C_P: FMC Carrier Channel2/U_FMC_connector (J2B.b16), FMC Carrier Channel2/FPGA_MGT (U2B#3.W20)
DP7_C2M_N: FMC Carrier Channel1/U_FMC_connector (J2A.b33), FMC Carrier Channel1/FPGA_MGT (C222A.2)
DP7_C2M_N: FMC Carrier Channel2/U_FMC_connector (J2B.b33), FMC Carrier Channel2/FPGA_MGT (C222B.2)
DP7_C2M_P: FMC Carrier Channel1/U_FMC_connector (J2A.b32), FMC Carrier Channel1/FPGA_MGT (C221A.2)
DP7_C2M_P: FMC Carrier Channel2/U_FMC_connector (J2B.b32), FMC Carrier Channel2/FPGA_MGT (C221B.2)
DP7_M2C_N: FMC Carrier Channel1/U_FMC_connector (J2A.b13), FMC Carrier Channel1/FPGA_MGT (U2A#3.AA19)
DP7_M2C_N: FMC Carrier Channel2/U_FMC_connector (J2B.b13), FMC Carrier Channel2/FPGA_MGT (U2B#3.AA19)
DP7_M2C_P: FMC Carrier Channel1/U_FMC_connector (J2A.b12), FMC Carrier Channel1/FPGA_MGT (U2A#3.AA20)
DP7_M2C_P: FMC Carrier Channel2/U_FMC_connector (J2B.b12), FMC Carrier Channel2/FPGA_MGT (U2B#3.AA20)
GA0: HDN_Management (P3.A6), MSP_Telemetry (IC29.44)
GA1: HDN_Management (P3.B6), MSP_Telemetry (IC29.45)
GA2: HDN_Management (P3.F6), MSP_Telemetry (IC29.46)
GA3: HDN_Management (P3.G6), MSP_Telemetry (IC29.47)
GA4: HDN_Management (P3.F5), MSP_Telemetry (IC29.48)
GAP: HDN_Management (P3.G5), MSP_Telemetry (IC29.49)
GBTCLK0_M2C_N: FMC Carrier Channel1/U_FMC_connector (J2A.d5), FMC Carrier Channel1/FPGA_MGT (C211A.2)
GBTCLK0_M2C_N: FMC Carrier Channel2/U_FMC_connector (J2B.d5), FMC Carrier Channel2/FPGA_MGT (C211B.2)
GBTCLK0_M2C_P: FMC Carrier Channel1/U_FMC_connector (J2A.d4), FMC Carrier Channel1/FPGA_MGT (C210A.2)
GBTCLK0_M2C_P: FMC Carrier Channel2/U_FMC_connector (J2B.d4), FMC Carrier Channel2/FPGA_MGT (C210B.2)
GBTCLK1_M2C_N: FMC Carrier Channel1/U_FMC_connector (J2A.b21), FMC Carrier Channel1/FPGA_MGT (C224A.2)
GBTCLK1_M2C_N: FMC Carrier Channel2/U_FMC_connector (J2B.b21), FMC Carrier Channel2/FPGA_MGT (C224B.2)
GBTCLK1_M2C_P: FMC Carrier Channel1/U_FMC_connector (J2A.b20), FMC Carrier Channel1/FPGA_MGT (C223A.2)
GBTCLK1_M2C_P: FMC Carrier Channel2/U_FMC_connector (J2B.b20), FMC Carrier Channel2/FPGA_MGT (C223B.2)
GPIO_A1: MSP_Telemetry (IC29.41), Interface_prot_A (IC27A.1)
GPIO_A2: MSP_Telemetry (IC29.42), Interface_prot_A (IC27A.4)
GPIO_A3: MSP_Telemetry (IC29.43), Interface_prot_A (IC27A.8)
GPIO_A4: MSP_Telemetry (IC29.63), Interface_prot_A (IC27A.11)
GPIO_B1: MSP_Telemetry (IC29.64), Interface_prot_B (IC27B.1)
GPIO_B2: MSP_Telemetry (IC29.35), Interface_prot_B (IC27B.4)
GPIO_B3: MSP_Telemetry (IC29.36), Interface_prot_B (IC27B.8)
GPIO_B4: MSP_Telemetry (IC29.62), Interface_prot_B (IC27B.11)
LA00_CC_N: FMC Carrier Channel1/U_FMC_connector (J2A.g7), FMC Carrier Channel1/FPGA_FMC (U2A#1.B17)
LA00_CC_N: FMC Carrier Channel2/U_FMC_connector (J2B.g7), FMC Carrier Channel2/FPGA_FMC (U2B#1.B17)
LA00_CC_P: FMC Carrier Channel1/U_FMC_connector (J2A.g6), FMC Carrier Channel1/FPGA_FMC (U2A#1.A17)
LA00_CC_P: FMC Carrier Channel2/U_FMC_connector (J2B.g6), FMC Carrier Channel2/FPGA_FMC (U2B#1.A17)
LA01_CC_N: FMC Carrier Channel1/U_FMC_connector (J2A.d9), FMC Carrier Channel1/FPGA_FMC (U2A#1.F17)
LA01_CC_N: FMC Carrier Channel2/U_FMC_connector (J2B.d9), FMC Carrier Channel2/FPGA_FMC (U2B#1.F17)
LA01_CC_P: FMC Carrier Channel1/U_FMC_connector (J2A.d8), FMC Carrier Channel1/FPGA_FMC (U2A#1.G17)
LA01_CC_P: FMC Carrier Channel2/U_FMC_connector (J2B.d8), FMC Carrier Channel2/FPGA_FMC (U2B#1.G17)
LA02_N: FMC Carrier Channel1/U_FMC_connector (J2A.h8), FMC Carrier Channel1/FPGA_FMC (U2A#1.B13)
LA02_N: FMC Carrier Channel2/U_FMC_connector (J2B.h8), FMC Carrier Channel2/FPGA_FMC (U2B#1.B13)
LA02_P: FMC Carrier Channel1/U_FMC_connector (J2A.h7), FMC Carrier Channel1/FPGA_FMC (U2A#1.B12)
LA02_P: FMC Carrier Channel2/U_FMC_connector (J2B.h7), FMC Carrier Channel2/FPGA_FMC (U2B#1.B12)
LA03_N: FMC Carrier Channel1/U_FMC_connector (J2A.g10), FMC Carrier Channel1/FPGA_FMC (U2A#1.A13)
LA03_N: FMC Carrier Channel2/U_FMC_connector (J2B.g10), FMC Carrier Channel2/FPGA_FMC (U2B#1.A13)
LA03_P: FMC Carrier Channel1/U_FMC_connector (J2A.g9), FMC Carrier Channel1/FPGA_FMC (U2A#1.A12)
LA03_P: FMC Carrier Channel2/U_FMC_connector (J2B.g9), FMC Carrier Channel2/FPGA_FMC (U2B#1.A12)
LA04_N: FMC Carrier Channel1/U_FMC_connector (J2A.h11), FMC Carrier Channel1/FPGA_FMC (U2A#1.F16)
LA04_N: FMC Carrier Channel2/U_FMC_connector (J2B.h11), FMC Carrier Channel2/FPGA_FMC (U2B#1.F16)
LA04_P: FMC Carrier Channel1/U_FMC_connector (J2A.h10), FMC Carrier Channel1/FPGA_FMC (U2A#1.F15)
LA04_P: FMC Carrier Channel2/U_FMC_connector (J2B.h10), FMC Carrier Channel2/FPGA_FMC (U2B#1.F15)
LA05_N: FMC Carrier Channel1/U_FMC_connector (J2A.d12), FMC Carrier Channel1/FPGA_FMC (U2A#1.D17)
LA05_N: FMC Carrier Channel2/U_FMC_connector (J2B.d12), FMC Carrier Channel2/FPGA_FMC (U2B#1.D17)
LA05_P: FMC Carrier Channel1/U_FMC_connector (J2A.d11), FMC Carrier Channel1/FPGA_FMC (U2A#1.D16)
LA05_P: FMC Carrier Channel2/U_FMC_connector (J2B.d11), FMC Carrier Channel2/FPGA_FMC (U2B#1.D16)
LA06_N: FMC Carrier Channel1/U_FMC_connector (J2A.c11), FMC Carrier Channel1/FPGA_FMC (U2A#1.B10)
LA06_N: FMC Carrier Channel2/U_FMC_connector (J2B.c11), FMC Carrier Channel2/FPGA_FMC (U2B#1.B10)
LA06_P: FMC Carrier Channel1/U_FMC_connector (J2A.c10), FMC Carrier Channel1/FPGA_FMC (U2A#1.B9)
LA06_P: FMC Carrier Channel2/U_FMC_connector (J2B.c10), FMC Carrier Channel2/FPGA_FMC (U2B#1.B9)
LA07_N: FMC Carrier Channel1/U_FMC_connector (J2A.h14), FMC Carrier Channel1/FPGA_FMC (U2A#1.G15)
LA07_N: FMC Carrier Channel2/U_FMC_connector (J2B.h14), FMC Carrier Channel2/FPGA_FMC (U2B#1.G15)
LA07_P: FMC Carrier Channel1/U_FMC_connector (J2A.h13), FMC Carrier Channel1/FPGA_FMC (U2A#1.H15)
LA07_P: FMC Carrier Channel2/U_FMC_connector (J2B.h13), FMC Carrier Channel2/FPGA_FMC (U2B#1.H15)
LA08_N: FMC Carrier Channel1/U_FMC_connector (J2A.g13), FMC Carrier Channel1/FPGA_FMC (U2A#1.C12)
LA08_N: FMC Carrier Channel2/U_FMC_connector (J2B.g13), FMC Carrier Channel2/FPGA_FMC (U2B#1.C12)
LA08_P: FMC Carrier Channel1/U_FMC_connector (J2A.g12), FMC Carrier Channel1/FPGA_FMC (U2A#1.C11)
LA08_P: FMC Carrier Channel2/U_FMC_connector (J2B.g12), FMC Carrier Channel2/FPGA_FMC (U2B#1.C11)
LA09_N: FMC Carrier Channel1/U_FMC_connector (J2A.d15), FMC Carrier Channel1/FPGA_FMC (U2A#1.A8)
LA09_N: FMC Carrier Channel2/U_FMC_connector (J2B.d15), FMC Carrier Channel2/FPGA_FMC (U2B#1.A8)
LA09_P: FMC Carrier Channel1/U_FMC_connector (J2A.d14), FMC Carrier Channel1/FPGA_FMC (U2A#1.B8)
LA09_P: FMC Carrier Channel2/U_FMC_connector (J2B.d14), FMC Carrier Channel2/FPGA_FMC (U2B#1.B8)
LA10_N: FMC Carrier Channel1/U_FMC_connector (J2A.c15), FMC Carrier Channel1/FPGA_FMC (U2A#1.A7)
LA10_N: FMC Carrier Channel2/U_FMC_connector (J2B.c15), FMC Carrier Channel2/FPGA_FMC (U2B#1.A7)
LA10_P: FMC Carrier Channel1/U_FMC_connector (J2A.c14), FMC Carrier Channel1/FPGA_FMC (U2A#1.A6)
LA10_P: FMC Carrier Channel2/U_FMC_connector (J2B.c14), FMC Carrier Channel2/FPGA_FMC (U2B#1.A6)
LA11_N: FMC Carrier Channel1/U_FMC_connector (J2A.h17), FMC Carrier Channel1/FPGA_FMC (U2A#1.B3)
LA11_N: FMC Carrier Channel2/U_FMC_connector (J2B.h17), FMC Carrier Channel2/FPGA_FMC (U2B#1.B3)
LA11_P: FMC Carrier Channel1/U_FMC_connector (J2A.h16), FMC Carrier Channel1/FPGA_FMC (U2A#1.B2)
LA11_P: FMC Carrier Channel2/U_FMC_connector (J2B.h16), FMC Carrier Channel2/FPGA_FMC (U2B#1.B2)
LA12_N: FMC Carrier Channel1/U_FMC_connector (J2A.g16), FMC Carrier Channel1/FPGA_FMC (U2A#1.B5)
LA12_N: FMC Carrier Channel2/U_FMC_connector (J2B.g16), FMC Carrier Channel2/FPGA_FMC (U2B#1.B5)
LA12_P: FMC Carrier Channel1/U_FMC_connector (J2A.g15), FMC Carrier Channel1/FPGA_FMC (U2A#1.C5)
LA12_P: FMC Carrier Channel2/U_FMC_connector (J2B.g15), FMC Carrier Channel2/FPGA_FMC (U2B#1.C5)
LA13_N: FMC Carrier Channel1/U_FMC_connector (J2A.d18), FMC Carrier Channel1/FPGA_FMC (U2A#1.F12)
LA13_N: FMC Carrier Channel2/U_FMC_connector (J2B.d18), FMC Carrier Channel2/FPGA_FMC (U2B#1.F12)
LA13_P: FMC Carrier Channel1/U_FMC_connector (J2A.d17), FMC Carrier Channel1/FPGA_FMC (U2A#1.F13)
LA13_P: FMC Carrier Channel2/U_FMC_connector (J2B.d17), FMC Carrier Channel2/FPGA_FMC (U2B#1.F13)
LA14_N: FMC Carrier Channel1/U_FMC_connector (J2A.c19), FMC Carrier Channel1/FPGA_FMC (U2A#1.A3)
LA14_N: FMC Carrier Channel2/U_FMC_connector (J2B.c19), FMC Carrier Channel2/FPGA_FMC (U2B#1.A3)
LA14_P: FMC Carrier Channel1/U_FMC_connector (J2A.c18), FMC Carrier Channel1/FPGA_FMC (U2A#1.A2)
LA14_P: FMC Carrier Channel2/U_FMC_connector (J2B.c18), FMC Carrier Channel2/FPGA_FMC (U2B#1.A2)
LA15_N: FMC Carrier Channel1/U_FMC_connector (J2A.h20), FMC Carrier Channel1/FPGA_FMC (U2A#1.E14)
LA15_N: FMC Carrier Channel2/U_FMC_connector (J2B.h20), FMC Carrier Channel2/FPGA_FMC (U2B#1.E14)
LA15_P: FMC Carrier Channel1/U_FMC_connector (J2A.h19), FMC Carrier Channel1/FPGA_FMC (U2A#1.D14)
LA15_P: FMC Carrier Channel2/U_FMC_connector (J2B.h19), FMC Carrier Channel2/FPGA_FMC (U2B#1.D14)
LA16_N: FMC Carrier Channel1/U_FMC_connector (J2A.g19), FMC Carrier Channel1/FPGA_FMC (U2A#1.C15)
LA16_N: FMC Carrier Channel2/U_FMC_connector (J2B.g19), FMC Carrier Channel2/FPGA_FMC (U2B#1.C15)
LA16_P: FMC Carrier Channel1/U_FMC_connector (J2A.g18), FMC Carrier Channel1/FPGA_FMC (U2A#1.C14)
LA16_P: FMC Carrier Channel2/U_FMC_connector (J2B.g18), FMC Carrier Channel2/FPGA_FMC (U2B#1.C14)
LA17_CC_N: FMC Carrier Channel1/U_FMC_connector (J2A.d21), FMC Carrier Channel1/FPGA_FMC (U2A#1.E16)
LA17_CC_N: FMC Carrier Channel2/U_FMC_connector (J2B.d21), FMC Carrier Channel2/FPGA_FMC (U2B#1.E16)
LA17_CC_P: FMC Carrier Channel1/U_FMC_connector (J2A.d20), FMC Carrier Channel1/FPGA_FMC (U2A#1.E15)
LA17_CC_P: FMC Carrier Channel2/U_FMC_connector (J2B.d20), FMC Carrier Channel2/FPGA_FMC (U2B#1.E15)
LA18_CC_N: FMC Carrier Channel1/U_FMC_connector (J2A.c23), FMC Carrier Channel1/FPGA_FMC (U2A#1.C2)
LA18_CC_N: FMC Carrier Channel2/U_FMC_connector (J2B.c23), FMC Carrier Channel2/FPGA_FMC (U2B#1.C2)
LA18_CC_P: FMC Carrier Channel1/U_FMC_connector (J2A.c22), FMC Carrier Channel1/FPGA_FMC (U2A#1.D2)
LA18_CC_P: FMC Carrier Channel2/U_FMC_connector (J2B.c22), FMC Carrier Channel2/FPGA_FMC (U2B#1.D2)
LA19_N: FMC Carrier Channel1/U_FMC_connector (J2A.h23), FMC Carrier Channel1/FPGA_FMC (U2A#1.G13)
LA19_N: FMC Carrier Channel2/U_FMC_connector (J2B.h23), FMC Carrier Channel2/FPGA_FMC (U2B#1.G13)
LA19_P: FMC Carrier Channel1/U_FMC_connector (J2A.h22), FMC Carrier Channel1/FPGA_FMC (U2A#1.G12)
LA19_P: FMC Carrier Channel2/U_FMC_connector (J2B.h22), FMC Carrier Channel2/FPGA_FMC (U2B#1.G12)
LA20_N: FMC Carrier Channel1/U_FMC_connector (J2A.g22), FMC Carrier Channel1/FPGA_FMC (U2A#1.D12)
LA20_N: FMC Carrier Channel2/U_FMC_connector (J2B.g22), FMC Carrier Channel2/FPGA_FMC (U2B#1.D12)
LA20_P: FMC Carrier Channel1/U_FMC_connector (J2A.g21), FMC Carrier Channel1/FPGA_FMC (U2A#1.D11)
LA20_P: FMC Carrier Channel2/U_FMC_connector (J2B.g21), FMC Carrier Channel2/FPGA_FMC (U2B#1.D11)
LA21_N: FMC Carrier Channel1/U_FMC_connector (J2A.h26), FMC Carrier Channel1/FPGA_FMC (U2A#1.E10)
LA21_N: FMC Carrier Channel2/U_FMC_connector (J2B.h26), FMC Carrier Channel2/FPGA_FMC (U2B#1.E10)
LA21_P: FMC Carrier Channel1/U_FMC_connector (J2A.h25), FMC Carrier Channel1/FPGA_FMC (U2A#1.F10)
LA21_P: FMC Carrier Channel2/U_FMC_connector (J2B.h25), FMC Carrier Channel2/FPGA_FMC (U2B#1.F10)
LA22_N: FMC Carrier Channel1/U_FMC_connector (J2A.g25), FMC Carrier Channel1/FPGA_FMC (U2A#1.C10)
LA22_N: FMC Carrier Channel2/U_FMC_connector (J2B.g25), FMC Carrier Channel2/FPGA_FMC (U2B#1.C10)
LA22_P: FMC Carrier Channel1/U_FMC_connector (J2A.g24), FMC Carrier Channel1/FPGA_FMC (U2A#1.C9)
LA22_P: FMC Carrier Channel2/U_FMC_connector (J2B.g24), FMC Carrier Channel2/FPGA_FMC (U2B#1.C9)
LA23_N: FMC Carrier Channel1/U_FMC_connector (J2A.d24), FMC Carrier Channel1/FPGA_FMC (U2A#1.B1)
LA23_N: FMC Carrier Channel2/U_FMC_connector (J2B.d24), FMC Carrier Channel2/FPGA_FMC (U2B#1.B1)
LA23_P: FMC Carrier Channel1/U_FMC_connector (J2A.d23), FMC Carrier Channel1/FPGA_FMC (U2A#1.C1)
LA23_P: FMC Carrier Channel2/U_FMC_connector (J2B.d23), FMC Carrier Channel2/FPGA_FMC (U2B#1.C1)
LA24_N: FMC Carrier Channel1/U_FMC_connector (J2A.h29), FMC Carrier Channel1/FPGA_FMC (U2A#1.E4)
LA24_N: FMC Carrier Channel2/U_FMC_connector (J2B.h29), FMC Carrier Channel2/FPGA_FMC (U2B#1.E4)
LA24_P: FMC Carrier Channel1/U_FMC_connector (J2A.h28), FMC Carrier Channel1/FPGA_FMC (U2A#1.F3)
LA24_P: FMC Carrier Channel2/U_FMC_connector (J2B.h28), FMC Carrier Channel2/FPGA_FMC (U2B#1.F3)
LA25_N: FMC Carrier Channel1/U_FMC_connector (J2A.g28), FMC Carrier Channel1/FPGA_FMC (U2A#1.D9)
LA25_N: FMC Carrier Channel2/U_FMC_connector (J2B.g28), FMC Carrier Channel2/FPGA_FMC (U2B#1.D9)
LA25_P: FMC Carrier Channel1/U_FMC_connector (J2A.g27), FMC Carrier Channel1/FPGA_FMC (U2A#1.E9)
LA25_P: FMC Carrier Channel2/U_FMC_connector (J2B.g27), FMC Carrier Channel2/FPGA_FMC (U2B#1.E9)
LA26_N: FMC Carrier Channel1/U_FMC_connector (J2A.d27), FMC Carrier Channel1/FPGA_FMC (U2A#1.E5)
LA26_N: FMC Carrier Channel2/U_FMC_connector (J2B.d27), FMC Carrier Channel2/FPGA_FMC (U2B#1.E5)
LA26_P: FMC Carrier Channel1/U_FMC_connector (J2A.d26), FMC Carrier Channel1/FPGA_FMC (U2A#1.F5)
LA26_P: FMC Carrier Channel2/U_FMC_connector (J2B.d26), FMC Carrier Channel2/FPGA_FMC (U2B#1.F5)
LA27_N: FMC Carrier Channel1/U_FMC_connector (J2A.c27), FMC Carrier Channel1/FPGA_FMC (U2A#1.H13)
LA27_N: FMC Carrier Channel2/U_FMC_connector (J2B.c27), FMC Carrier Channel2/FPGA_FMC (U2B#1.H13)
LA27_P: FMC Carrier Channel1/U_FMC_connector (J2A.c26), FMC Carrier Channel1/FPGA_FMC (U2A#1.G14)
LA27_P: FMC Carrier Channel2/U_FMC_connector (J2B.c26), FMC Carrier Channel2/FPGA_FMC (U2B#1.G14)
LA28_N: FMC Carrier Channel1/U_FMC_connector (J2A.h32), FMC Carrier Channel1/FPGA_FMC (U2A#1.D3)
LA28_N: FMC Carrier Channel2/U_FMC_connector (J2B.h32), FMC Carrier Channel2/FPGA_FMC (U2B#1.D3)
LA28_P: FMC Carrier Channel1/U_FMC_connector (J2A.h31), FMC Carrier Channel1/FPGA_FMC (U2A#1.E3)
LA28_P: FMC Carrier Channel2/U_FMC_connector (J2B.h31), FMC Carrier Channel2/FPGA_FMC (U2B#1.E3)
LA29_N: FMC Carrier Channel1/U_FMC_connector (J2A.g31), FMC Carrier Channel1/FPGA_FMC (U2A#1.D8)
LA29_N: FMC Carrier Channel2/U_FMC_connector (J2B.g31), FMC Carrier Channel2/FPGA_FMC (U2B#1.D8)
LA29_P: FMC Carrier Channel1/U_FMC_connector (J2A.g30), FMC Carrier Channel1/FPGA_FMC (U2A#1.E8)
LA29_P: FMC Carrier Channel2/U_FMC_connector (J2B.g30), FMC Carrier Channel2/FPGA_FMC (U2B#1.E8)
LA30_N: FMC Carrier Channel1/U_FMC_connector (J2A.h35), FMC Carrier Channel1/FPGA_FMC (U2A#1.D6)
LA30_N: FMC Carrier Channel2/U_FMC_connector (J2B.h35), FMC Carrier Channel2/FPGA_FMC (U2B#1.D6)
LA30_P: FMC Carrier Channel1/U_FMC_connector (J2A.h34), FMC Carrier Channel1/FPGA_FMC (U2A#1.E6)
LA30_P: FMC Carrier Channel2/U_FMC_connector (J2B.h34), FMC Carrier Channel2/FPGA_FMC (U2B#1.E6)
LA31_N: FMC Carrier Channel1/U_FMC_connector (J2A.g34), FMC Carrier Channel1/FPGA_FMC (U2A#1.B7)
LA31_N: FMC Carrier Channel2/U_FMC_connector (J2B.g34), FMC Carrier Channel2/FPGA_FMC (U2B#1.B7)
LA31_P: FMC Carrier Channel1/U_FMC_connector (J2A.g33), FMC Carrier Channel1/FPGA_FMC (U2A#1.C6)
LA31_P: FMC Carrier Channel2/U_FMC_connector (J2B.g33), FMC Carrier Channel2/FPGA_FMC (U2B#1.C6)
LA32_N: FMC Carrier Channel1/U_FMC_connector (J2A.h38), FMC Carrier Channel1/FPGA_FMC (U2A#1.C4)
LA32_N: FMC Carrier Channel2/U_FMC_connector (J2B.h38), FMC Carrier Channel2/FPGA_FMC (U2B#1.C4)
LA32_P: FMC Carrier Channel1/U_FMC_connector (J2A.h37), FMC Carrier Channel1/FPGA_FMC (U2A#1.D4)
LA32_P: FMC Carrier Channel2/U_FMC_connector (J2B.h37), FMC Carrier Channel2/FPGA_FMC (U2B#1.D4)
LA33_N: FMC Carrier Channel1/U_FMC_connector (J2A.g37), FMC Carrier Channel1/FPGA_FMC (U2A#1.A5)
LA33_N: FMC Carrier Channel2/U_FMC_connector (J2B.g37), FMC Carrier Channel2/FPGA_FMC (U2B#1.A5)
LA33_P: FMC Carrier Channel1/U_FMC_connector (J2A.g36), FMC Carrier Channel1/FPGA_FMC (U2A#1.B4)
LA33_P: FMC Carrier Channel2/U_FMC_connector (J2B.g36), FMC Carrier Channel2/FPGA_FMC (U2B#1.B4)
NetD5_2: MSP_Telemetry (IC29.55), FRAM_memory (D5.2 R107.1 R108.1)
NetD10_1: MSP_Telemetry (IC29.53 R162.1), FRAM_memory (D10.1 T6.3)
NetD11_1: MSP_Telemetry (IC29.54 R163.1), FRAM_memory (D11.1 T7.3)
NetIC1A_12: FMC Carrier Channel1/FPGA_RGMII_Misc (U2A#2.M3), FMC Carrier Channel1/U_CAN_IFC (IC1A.12)
NetIC1B_12: FMC Carrier Channel2/FPGA_RGMII_Misc (U2B#2.M3), FMC Carrier Channel2/U_CAN_IFC (IC1B.12)
NetIC18A_2: MSP_Telemetry (IC29.65), Interface_prot_A (IC18A.2)
NetIC18B_2: MSP_Telemetry (IC29.69), Interface_prot_B (IC18B.2)
NetIC19A_2: MSP_Telemetry (IC29.67), Interface_prot_A (IC19A.2)
NetIC19B_2: MSP_Telemetry (IC29.71), Interface_prot_B (IC19B.2)
NetIC20A_2: MSP_Telemetry (IC29.68), Interface_prot_A (IC20A.2)
NetIC20B_2: MSP_Telemetry (IC29.72), Interface_prot_B (IC20B.2)
NetIC26_1: MSP_Telemetry (IC29.10), MSP_Power_Program (IC26.1)
REF_CLK_A_N: FMC Carrier Channel1/FPGA_RGMII_Misc (U2A#2.R3), HDN_Management (P3.F8)
REF_CLK_A_N: FMC Carrier Channel2/FPGA_RGMII_Misc (U2B#2.R3), HDN_Control_Data (P1.G11)
REF_CLK_A_P: FMC Carrier Channel1/FPGA_RGMII_Misc (U2A#2.P4), HDN_Management (P3.E8)
REF_CLK_A_P: FMC Carrier Channel2/FPGA_RGMII_Misc (U2B#2.P4), HDN_Control_Data (P1.G13)
RxD: MSP_Telemetry (IC29.9), MSP_Power_Program (D16.6 J1.4)
SCL: FMC Carrier Channel1/U_FMC_connector (J2A.c30), FMC Carrier Channel1/FPGA_FMC (R85A.1 U2A#1.E1)
SCL: FMC Carrier Channel2/U_FMC_connector (J2B.c30), FMC Carrier Channel2/FPGA_FMC (R85B.1 U2B#1.E1)
SDA: FMC Carrier Channel1/U_FMC_connector (J2A.c31), FMC Carrier Channel1/FPGA_FMC (R86A.1 U2A#1.D1)
SDA: FMC Carrier Channel2/U_FMC_connector (J2B.c31), FMC Carrier Channel2/FPGA_FMC (R86B.1 U2B#1.D1)
SM0: HDN_Management (D12.6 P3.B5), MSP_Telemetry (IC29.52 R161.1)
SM1: HDN_Management (D12.4 P3.A5), MSP_Telemetry (IC29.51 R160.1)
SM2: HDN_Management (D12.3 P3.G4), MSP_Power_Program (D15.1)
SM3: HDN_Management (D12.1 P3.F4), MSP_Telemetry (IC29.56)
SpW_A_Din_N: FMC Carrier Channel1/FPGA_RGMII_Misc (U2A#2.M4), HDN_Control_Data (P1.C16)
SpW_A_Din_P: FMC Carrier Channel1/FPGA_RGMII_Misc (U2A#2.L3), HDN_Control_Data (P1.B16)
SpW_A_Dout_N: FMC Carrier Channel1/FPGA_RGMII_Misc (U2A#2.M7), HDN_Control_Data (P1.F16)
SpW_A_Dout_P: FMC Carrier Channel1/FPGA_RGMII_Misc (U2A#2.L6), HDN_Control_Data (P1.E16)
SpW_A_Sin_N: FMC Carrier Channel1/FPGA_RGMII_Misc (U2A#2.M5), HDN_Control_Data (P1.B15)
SpW_A_Sin_P: FMC Carrier Channel1/FPGA_RGMII_Misc (U2A#2.L5), HDN_Control_Data (P1.A15)
SpW_A_Sout_N: FMC Carrier Channel1/FPGA_RGMII_Misc (U2A#2.K4), HDN_Control_Data (P1.E15)
SpW_A_Sout_P: FMC Carrier Channel1/FPGA_RGMII_Misc (U2A#2.K5), HDN_Control_Data (P1.D15)
SpW_B_Din_N: FMC Carrier Channel2/FPGA_RGMII_Misc (U2B#2.M4), HDN_Control_Data (P1.C14)
SpW_B_Din_P: FMC Carrier Channel2/FPGA_RGMII_Misc (U2B#2.L3), HDN_Control_Data (P1.B14)
SpW_B_Dout_N: FMC Carrier Channel2/FPGA_RGMII_Misc (U2B#2.M7), HDN_Control_Data (P1.F14)
SpW_B_Dout_P: FMC Carrier Channel2/FPGA_RGMII_Misc (U2B#2.L6), HDN_Control_Data (P1.E14)
SpW_B_Sin_N: FMC Carrier Channel2/FPGA_RGMII_Misc (U2B#2.M5), HDN_Control_Data (P1.B13)